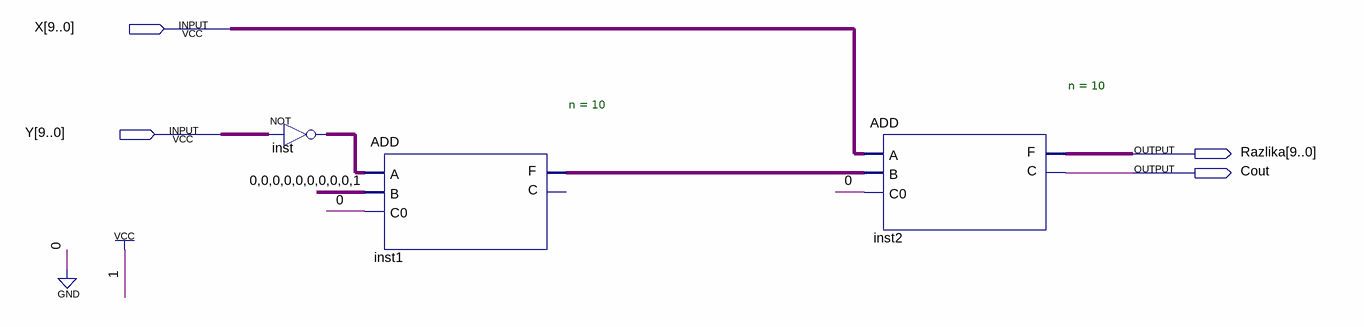
[diagram p0: schematic sheet]
// Quartus schematic SUB10.bdf as structural Verilog: 3 symbols, 4 pins
module SUB10 (
  input  [9:0] X,
  input  [9:0] Y,
  output [9:0] Razlika,
  output Cout
);

  wire [9:0] inst1_f, inst_out;

  assign inst_out = ~Y;  // NOT inst, 10 bits wide
  ADD #(.n(10)) inst1 (.C0(1'b0), .A(inst_out), .B(10'b0000000001), .F(inst1_f));  // open: C
  ADD #(.n(10)) inst2 (.C0(1'b0), .A(X), .B(inst1_f), .C(Cout), .F(Razlika));
endmodule
